# Altium schematic sheet DAC SPI.SchDoc
size Letter; SheetNumber: 11; SheetTotal: 22
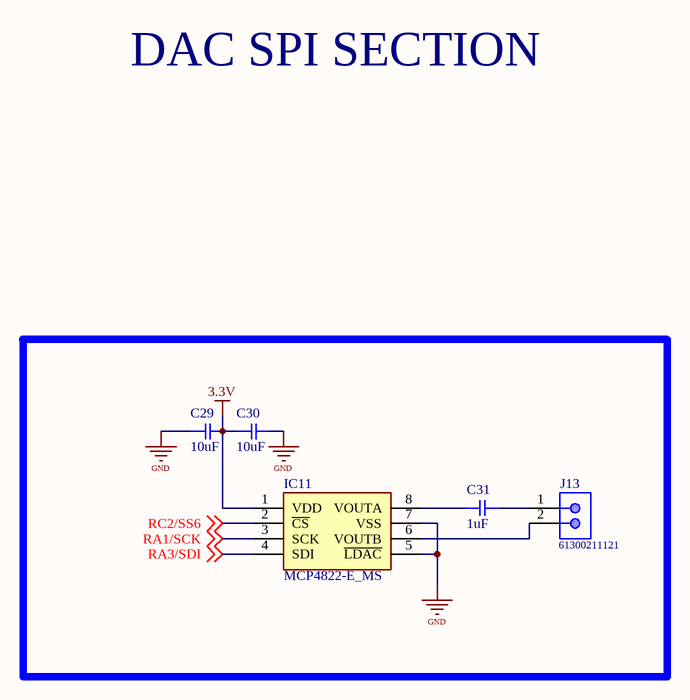
[diagram p0: DAC SPI.SchDoc]

## Parts
C29  10uF  [SMD-0805C]
C30  10uF  [SMD-0805C]
C31  1uF  [SMD-0805C]
IC11  MCP4822-E_MS  [SOP65P490X110-8N]
J13  61300211121  [61300211121]

## Nets
3.3V: C29.2 C30.1 IC11.1(VDD)
GND: C29.1 C30.2 IC11.5(~{LDAC}) IC11.7(VSS)
RA1/SCK: IC11.3(SCK) ; off-sheet RA1/SCK
RA3/SDI: IC11.4(SDI) ; off-sheet RA3/SDI
RC2/SS6: IC11.2(~{CS}) ; off-sheet RC2/SS6
NetC31_1: C31.1 J13.1
NetC31_2: C31.2 IC11.8(VOUTA)
NetIC11_6: IC11.6(VOUTB) J13.2

## Notes on the sheet
- DAC SPI SECTION

## Library data of the parts
C29-C31 = GCD21BR71H104KA01L: CAP CER 0.1UF 50V X7R 0805; Manufacturer: Murata Electronics North America; Factory Stock: 0; Unit Price (USD): 0.24; Minimum Quantity: 1; Value: 0.10µF; Tolerance: ±10%; Datasheets: http://www.murata.com/~/media/webrenewal/support/library/catalog/products/capacitor/mlcc/c03e.ashx; Image: //media.digikey.com/Renders/Murata%20Renders/0805%28GxM6%29.jpg; Digi-Key Part Number: 490-11955-1-ND; Part Number: GCD21BR71H104KA01L; Quantity Available: 157; @ qty: 0; Packaging: Cut Tape (CT); Series: GCD; Part Status: Active; Voltage: 50V; Temperature Coefficient: X7R; Operating Temperature: -55°C ~ 125°C; Features: -; Ratings: AEC-Q200; Applications: Automotive; Mounting Type: Surface Mount, MLCC; Package / Case: 0805 (2012 Metric); Size / Dimension: 0.079" L x 0.049" W (2.00mm x 1.25mm); Height - Seated (Max): -; Thickness (Max): 0.049" (1.25mm); Lead Spacing: -; Lead Style: -
IC11 = MCP4822-E_MS: Integrated Circuit; Manufacturer_Name: Microchip; Manufacturer_Part_Number: MCP4822-E/MS; Datasheet Link: https://datasheet.datasheetarchive.com/originals/distributors/Datasheets-DGA17/911642.pdf; Height: 1.1mm; Mouser Part Number: 579-MCP4822-E/MS; Mouser Price/Stock: https://www.mouser.co.uk/ProductDetail/Microchip-Technology/MCP4822-E-MS?qs=usxtMOJb1Rzc5xsp0Zr6iQ%3D%3D; Arrow Part Number: MCP4822-E/MS; Arrow Price/Stock: https://www.arrow.com/en/products/mcp4822-ems/microchip-technology?region=europe
J13 = 61300211121: WR-PHD Pin Header, THT, pitch 2.54mm, Single Row, Vertical, 2pin; Pin Number: 2; Gender: Male; Rated Current: 3A; Working Voltage: 250VAC; Withstanding Voltage: 500VAC; Contact Resistance: 20mOhm; ComponentLink1Description: Manufacturer; ComponentLink1URL: http://www.we-online.de; ComponentLink2Description: Datasheet; ComponentLink2URL: https://katalog.we-online.de/em/datasheet/6130xx11121.pdf; Part Number: 61300211121; Published Date: June 2019; Publisher: Wurth Elektronik; Pitch: 2.54mm; Operating Temperature: -40 to +105degC; Mounting Technology: THT; Packaging: Bag; Row Number: Single; Orientation: Vertical